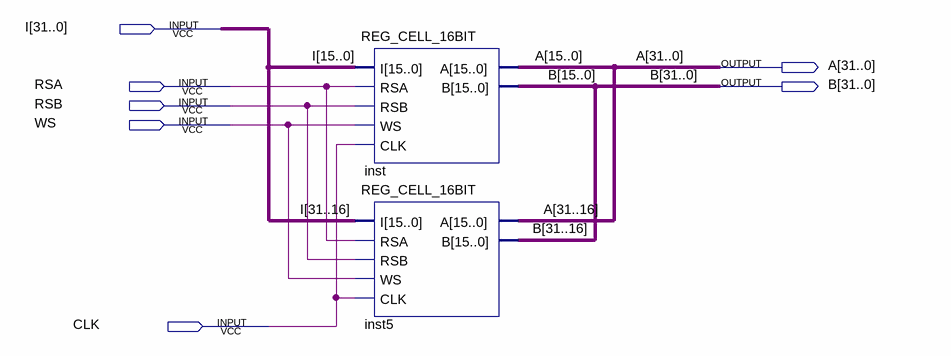
[diagram p0: schematic sheet]
// Quartus schematic REG_CELL_32BIT.bdf as structural Verilog: 2 symbols, 7 pins
module REG_CELL_32BIT (
  input  [31:0] I,
  input  RSA,
  input  RSB,
  input  WS,
  input  CLK,
  output [31:0] A,
  output [31:0] B
);

  REG_CELL_16BIT inst (.I(I[15:0]), .RSA(RSA), .RSB(RSB), .WS(WS), .CLK(CLK), .A(A[15:0]), .B(B[15:0]));
  REG_CELL_16BIT inst5 (.I(I[31:16]), .RSA(RSA), .RSB(RSB), .WS(WS), .CLK(CLK), .A(A[31:16]), .B(B[31:16]));
endmodule
